# EAGLE schematic untitled (EAGLE 6.4)
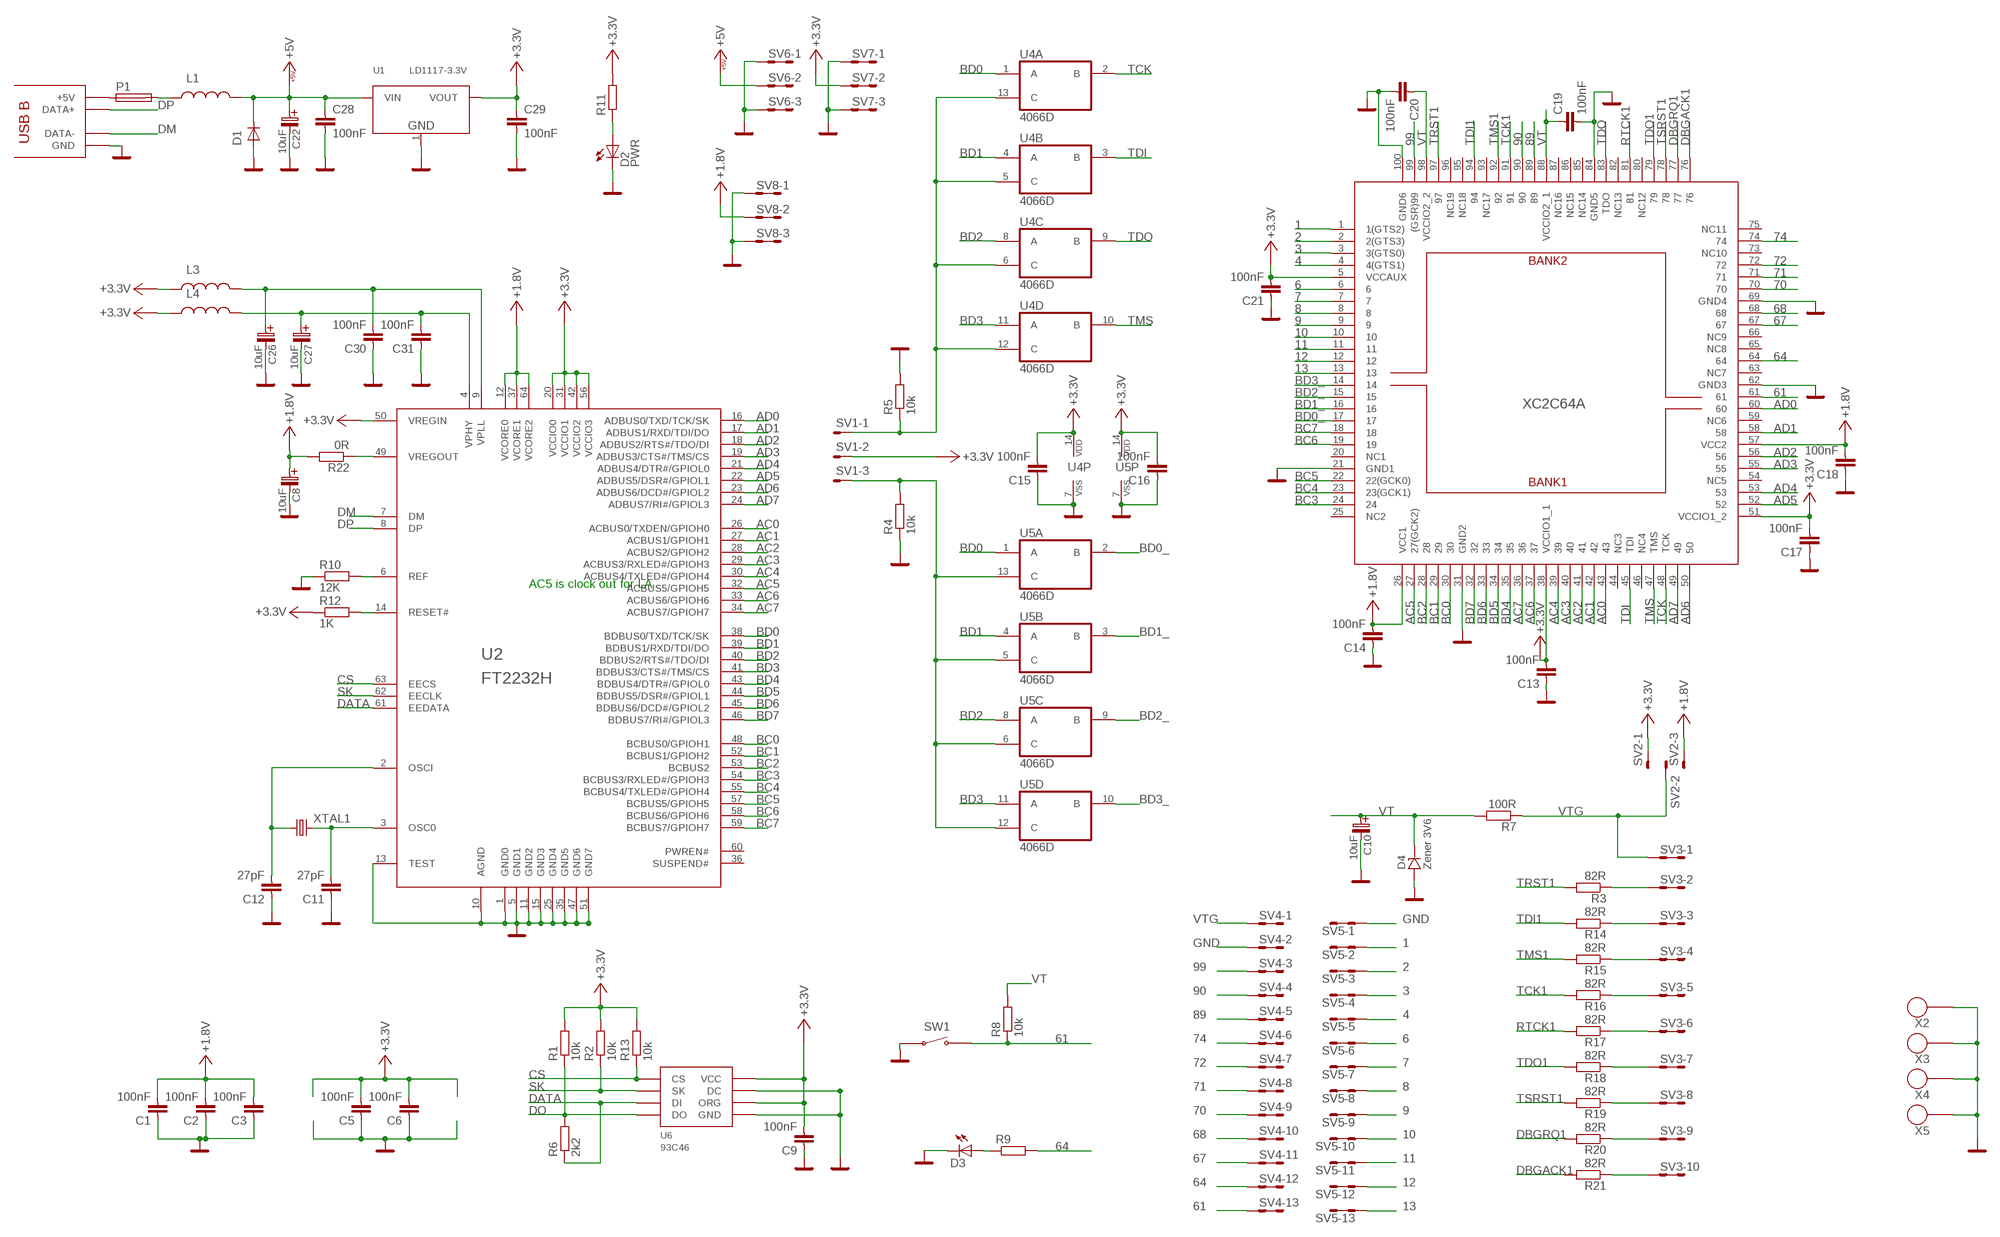
[diagram p0: schematic, sheet 1]

## Parts
C1  100nF  C0805  [C0805]
C2  100nF  C0805  [C0805]
C3  100nF  C0805  [C0805]
C5  100nF  C0805  [C0805]
C6  100nF  C0805  [C0805]
C8  10uF  B  [B]
C9  100nF  C0805  [C0805]
C10  10uF  B  [B]
C11  27pF  C0805  [C0805]
C12  27pF  C0805  [C0805]
C13  100nF  C0805  [C0805]
C14  100nF  C0805  [C0805]
C15  100nF  C0805  [C0805]
C16  100nF  C0805  [C0805]
C17  100nF  C0805  [C0805]
C18  100nF  C0805  [C0805]
C19  100nF  C0805  [C0805]
C20  100nF  C0805  [C0805]
C21  100nF  C0805  [C0805]
C22  10uF  B  [B]
C26  10uF  B  [B]
C27  10uF  B  [B]
C28  100nF  C0805  [C0805]
C29  100nF  C0805  [C0805]
C30  100nF  C0805  [C0805]
C31  100nF  C0805  [C0805]
D1  D-OB.SMA  [SMA]
D2  PWR  LED1206  [1206]
D3  LED1206  [1206]
D4  Zener 3V6  D-ZENEROVA  [MINIMELF]
L1  L0805  [L0805]
L3  L1210  [1210]
L4  L1210  [1210]
P1  POJISTKA_1812  [1812]
R1  10k  R0805  [0805]
R2  10k  R0805  [0805]
R3  82R  R0805  [0805]
R4  10k  R0805  [0805]
R5  10k  R0805  [0805]
R6  2k2  R0805  [0805]
R7  100R  R0805  [0805]
R8  10k  R0805  [0805]
R9  R0805  [0805]
R10  12K  R0805  [0805]
R11  R0805  [0805]
R12  1K  R0805  [0805]
R13  10k  R0805  [0805]
R14  82R  R0805  [0805]
R15  82R  R0805  [0805]
R16  82R  R0805  [0805]
R17  82R  R0805  [0805]
R18  82R  R0805  [0805]
R19  82R  R0805  [0805]
R20  82R  R0805  [0805]
R21  82R  R0805  [0805]
R22  0R  R0805  [0805]
SV1  MA03-1  [MA03-1]
SV2  MA03-1  [MA03-1]
SV3  MA10-2  [MA10-2]
SV4  MA13-2  [MA13-2]
SV5  MA13-2  [MA13-2]
SV6  MA03-2  [MA03-2]
SV7  MA03-2  [MA03-2]
SV8  MA03-2  [MA03-2]
SW1  TACT-64K  [TACT-64K]
U1  LD1117-3.3V  LD1117-3.3SOT223  [SOT223]
U2  FT2232H  [LQFP64]
U3  XC2C64A  [VQ100]
U4  4066D  [SO14]
U5  4066D  [SO14]
U6  93C46  [SOIC8]
X1  USB_B  [USB_B]
X2  SROUB3M  [SROUB3M]
X3  SROUB3M  [SROUB3M]
X4  SROUB3M  [SROUB3M]
X5  SROUB3M  [SROUB3M]
XTAL1  KRYSLAL_S49  [S49]

## Nets
1: SV5.3 SV5.4 U3.1(1(GTS2))
2: SV5.5 SV5.6 U3.2(2(GTS3))
3: SV5.7 SV5.8 U3.3(3(GTS0))
4: SV5.9 SV5.10 U3.4(4(GTS1))
6: SV5.11 SV5.12 U3.6
7: SV5.13 SV5.14 U3.7
8: SV5.15 SV5.16 U3.8
9: SV5.17 SV5.18 U3.9
10: SV5.19 SV5.20 U3.10
11: SV5.21 SV5.22 U3.11
12: SV5.23 SV5.24 U3.12
13: SV5.25 SV5.26 U3.13
61: R8.1 SV4.25 SV4.26 SW1.P$3 SW1.P$4 U3.61
64: R9.2 SV4.23 SV4.24 U3.64
67: SV4.21 SV4.22 U3.67
68: SV4.19 SV4.20 U3.68
70: SV4.17 SV4.18 U3.70
71: SV4.15 SV4.16 U3.71
72: SV4.13 SV4.14 U3.72
74: SV4.11 SV4.12 U3.74
89: SV4.9 SV4.10 U3.89
90: SV4.7 SV4.8 U3.90
99: SV4.5 SV4.6 U3.99((GSR)99)
+1.8V: C1.2 C2.2 C3.2 C8.+(C_EL+) C14.2 C18.2 R22.2 SV2.3 SV8.3 SV8.4 U2.12(VCORE0) U2.37(VCORE1) U2.64(VCORE2) U3.26(VCC1) U3.57(VCC2)
+3.3V: C5.2 C6.2 C9.2 C13.2 C15.2 C16.2 C17.2 C21.2 C29.1 L3.P$1 L4.P$1 R1.2 R2.2 R11.2 R12.1 R13.2 SV1.2 SV2.1 SV7.3 SV7.4 U1.2(VOUT) U2.20(VCCIO0) U2.31(VCCIO1) U2.42(VCCIO2) U2.50(VREGIN) U2.56(VCCIO3) U3.5(VCCAUX) U3.38(VCCIO1_1) U3.51(VCCIO1_2) U4.14(P:VDD) U5.14(P:VDD) U6.6(ORG) U6.8(VCC)
+5V: C22.+(C_EL+) C28.1 D1.K(C) L1.2 SV6.3 SV6.4 U1.3(VIN)
AC0: U2.26(ACBUS0/TXDEN/GPIOH0) U3.43
AC1: U2.27(ACBUS1/GPIOH1) U3.42
AC2: U2.28(ACBUS2/GPIOH2) U3.41
AC3: U2.29(ACBUS3/RXLED#/GPIOH3) U3.40
AC4: U2.30(ACBUS4/TXLED#/GPIOH4) U3.39
AC5: U2.32(ACBUS5/GPIOH5) U3.27(27(GCK2))
AC6: U2.33(ACBUS6/GPIOH6) U3.37
AC7: U2.34(ACBUS7/GPIOH7) U3.36
AD0: U2.16(ADBUS0/TXD/TCK/SK) U3.60
AD1: U2.17(ADBUS1/RXD/TDI/DO) U3.58
AD2: U2.18(ADBUS2/RTS#/TDO/DI) U3.56
AD3: U2.19(ADBUS3/CTS#/TMS/CS) U3.55
AD4: U2.21(ADBUS4/DTR#/GPIOL0) U3.53
AD5: U2.22(ADBUS5/DSR#/GPIOL1) U3.52
AD6: U2.23(ADBUS6/DCD#/GPIOL2) U3.50
AD7: U2.24(ADBUS7/RI#/GPIOL3) U3.49
BC0: U2.48(BCBUS0/GPIOH1) U3.30
BC1: U2.52(BCBUS1/GPIOH2) U3.29
BC2: U2.53(BCBUS2) U3.28
BC3: U2.54(BCBUS3/RXLED#/GPIOH3) U3.24
BC4: U2.55(BCBUS4/TXLED#/GPIOH4) U3.23(23(GCK1))
BC5: U2.57(BCBUS5/GPIOH5) U3.22(22(GCK0))
BC6: U2.58(BCBUS6/GPIOH6) U3.19
BC7: U2.59(BCBUS7/GPIOH7) U3.18
BD0: U2.38(BDBUS0/TXD/TCK/SK) U4.1(A:A) U5.1(A:A)
BD0_: U3.17 U5.2(A:B)
BD1: U2.39(BDBUS1/RXD/TDI/DO) U4.4(B:A) U5.4(B:A)
BD1_: U3.16 U5.3(B:B)
BD2: U2.40(BDBUS2/RTS#/TDO/DI) U4.8(C:A) U5.8(C:A)
BD2_: U3.15 U5.9(C:B)
BD3: U2.41(BDBUS3/CTS#/TMS/CS) U4.11(D:A) U5.11(D:A)
BD3_: U3.14 U5.10(D:B)
BD4: U2.43(BDBUS4/DTR#/GPIOL0) U3.35
BD5: U2.44(BDBUS5/DSR#/GPIOL1) U3.34
BD6: U2.45(BDBUS6/DCD#/GPIOL2) U3.33
BD7: U2.46(BDBUS7/RI#/GPIOL3) U3.32
CS: R13.1 U2.63(EECS) U6.1(CS)
DATA: R6.1 U2.61(EEDATA) U6.3(DI)
DBGACK1: R21.2 U3.76
DBGRQ1: R20.2 U3.77
DM: U2.7(DM) X1.2(DATA-)
DO: R1.1 R6.2 U6.4(DO)
DP: U2.8(DP) X1.3(DATA+)
GND: C1.1 C2.1 C3.1 C5.1 C6.1 C8.-(C_EL-) C9.1 C10.-(C_EL-) C11.1 C12.1 C13.1 C14.1 C15.1 C16.1 C17.1 C18.1 C19.2 C20.2 C21.1 C22.-(C_EL-) C26.-(C_EL-) C27.-(C_EL-) C28.2 C29.2 C30.1 C31.1 D1.A D2.K(C) D3.K(C) D4.A R4.1 R5.2 R10.1 SV4.3 SV4.4 SV5.1 SV5.2 SV6.1 SV6.2 SV6.5 SV6.6 SV7.1 SV7.2 SV7.5 SV7.6 SV8.1 SV8.2 SV8.5 SV8.6 SW1.P$1 SW1.P$2 U1.1(GND) U2.1(GND0) U2.5(GND1) U2.10(AGND) U2.11(GND2) U2.13(TEST) U2.15(GND3) U2.25(GND4) U2.35(GND5) U2.47(GND6) U2.51(GND7) U3.21(GND1) U3.31(GND2) U3.62(GND3) U3.69(GND4) U3.84(GND5) U3.100(GND6) U4.7(P:VSS) U5.7(P:VSS) U6.5(GND) U6.7(DC) X1.4(GND) X1.GND X1.GND2(GND) X2.P$1 X3.P$1 X4.P$1 X5.P$1
N$1: C11.2 U2.3(OSC0) XTAL1.P$2
N$2: C12.2 U2.2(OSCI) XTAL1.P$1
N$3: R10.2 U2.6(REF)
N$4: R12.2 U2.14(RESET#)
N$5: R3.1 SV3.3 SV3.4
N$6: D3.A R9.1
N$7: D2.A R11.1
N$8: P1.1 X1.1(+5V)
N$9: L1.1 P1.2
N$10: R14.1 SV3.5 SV3.6
N$11: R15.1 SV3.7 SV3.8
N$12: R16.1 SV3.9 SV3.10
N$13: R17.1 SV3.11 SV3.12
N$14: R18.1 SV3.13 SV3.14
N$15: R19.1 SV3.15 SV3.16
N$16: R20.1 SV3.17 SV3.18
N$17: R21.1 SV3.19 SV3.20
N$18: R22.1 U2.49(VREGOUT)
N$72: R5.1 SV1.1 U4.5(B:C) U4.6(C:C) U4.12(D:C) U4.13(A:C)
N$73: R4.2 SV1.3 U5.5(B:C) U5.6(C:C) U5.12(D:C) U5.13(A:C)
RTCK1: R17.2 U3.81
SK: R2.1 U2.62(EECLK) U6.2(SK)
TCK: U3.48(TCK) U4.2(A:B)
TCK1: R16.2 U3.91
TDI: U3.45(TDI) U4.3(B:B)
TDI1: R14.2 U3.94
TDO: U3.83(TDO) U4.9(C:B)
TDO1: R18.2 U3.79
TMS: U3.47(TMS) U4.10(D:B)
TMS1: R15.2 U3.92
TRST1: R3.2 U3.97
TSRST1: R19.2 U3.78
VPHY: C27.+(C_EL+) C31.2 L4.P$2 U2.4(VPHY)
VPLL: C26.+(C_EL+) C30.2 L3.P$2 U2.9(VPLL)
VT: C10.+(C_EL+) C19.1 C20.1 D4.C(K) R7.2 R8.2 U3.88(VCCIO2_1) U3.98(VCCIO2_2)
VTG: R7.1 SV2.2 SV3.1 SV3.2 SV4.1 SV4.2
Unconnected: U2.36(SUSPEND#) U2.60(PWREN#) U3.20(NC1) U3.25(NC2) U3.44(NC3) U3.46(NC4) U3.54(NC5) U3.59(NC6) U3.63(NC7) U3.65(NC8) U3.66(NC9) U3.73(NC10) U3.75(NC11) U3.80(NC12) U3.82(NC13) U3.85(NC14) U3.86(NC15) U3.87(NC16) U3.93(NC17) U3.95(NC18) U3.96(NC19)

## Notes on the sheet
- XC2C64A
- AC5 is clock out for LA

## Library data of the parts
C1-C3 C5 C6 C9 C11-C21 C28-C31 = moje_C:C0805
C8 C10 C22 C26 C27 = moje_C:B
D1 = moje:D-OB.SMA: SMA
D2 D3 = moje_diody:LED1206: Ecom LEDS-HCL-1505
D4 = moje_diody:D-ZENEROVA
L1 = moje_L:L0805
L3 L4 = moje_L:L1210
P1 = moje:POJISTKA_1812: Pojistka s pouzdrem 1812
R1-R22 = moje_R:R0805
SV1 SV2 = moje_hrebinky:MA03-1: PIN HEADER; OC_FARNELL: unknown; OC_NEWARK: unknown
SV3 = moje_hrebinky:MA10-2: PIN HEADER; OC_FARNELL: unknown; OC_NEWARK: unknown
SV4 SV5 = moje_hrebinky:MA13-2: PIN HEADER; OC_FARNELL: unknown; OC_NEWARK: unknown
SV6-SV8 = moje_hrebinky:MA03-2: PIN HEADER; OC_FARNELL: unknown; OC_NEWARK: unknown
SW1 = moje_tlacitka:TACT-64K: Resetovací tlačítko TACT-64K
U1 = dp_devices:LD1117-3.3
U2 = dp_devices:FT2232H: DUAL HIGH SPEED USB TO MULTIPURPOSE UART/FIFO IC
U3 = fpga:XC2C64A
U4 U5 = 40xx:4066: Quad bilateral ANALOG SWITCH
U6 = DP-EagleLibrary:93C46
X1 = moje_konektory:USB_B
X2-X5 = moje:SROUB3M
XTAL1 = moje_krystaly:KRYSLAL_S49